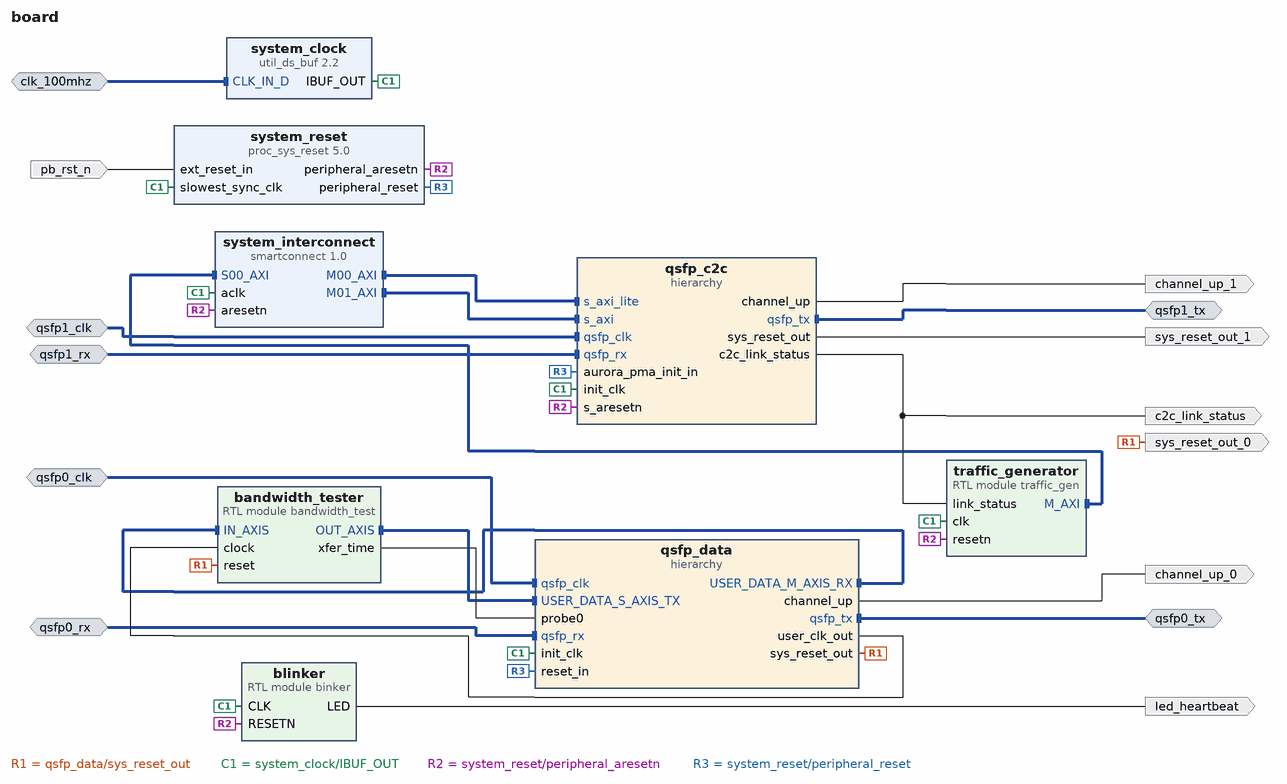
[diagram p0: block diagram of the top level]
# Vivado block design board, xczu19eg-ffvc1760-2-i, Vivado 2021.1
create_bd_design board

create_bd_intf_port -mode Slave -vlnv xilinx.com:interface:diff_clock_rtl:1.0 clk_100mhz
create_bd_intf_port -mode Slave -vlnv xilinx.com:interface:diff_clock_rtl:1.0 qsfp1_clk
set_property -dict {CONFIG.FREQ_HZ 322265625} [get_bd_intf_ports qsfp1_clk]
create_bd_intf_port -mode Slave -vlnv xilinx.com:display_aurora:GT_Serial_Transceiver_Pins_RX_rtl:1.0 qsfp1_rx
create_bd_intf_port -mode Master -vlnv xilinx.com:display_aurora:GT_Serial_Transceiver_Pins_TX_rtl:1.0 qsfp1_tx
create_bd_intf_port -mode Slave -vlnv xilinx.com:interface:diff_clock_rtl:1.0 qsfp0_clk
set_property -dict {CONFIG.FREQ_HZ 322265625} [get_bd_intf_ports qsfp0_clk]
create_bd_intf_port -mode Master -vlnv xilinx.com:display_aurora:GT_Serial_Transceiver_Pins_TX_rtl:1.0 qsfp0_tx
create_bd_intf_port -mode Slave -vlnv xilinx.com:display_aurora:GT_Serial_Transceiver_Pins_RX_rtl:1.0 qsfp0_rx
create_bd_port -dir O led_heartbeat
create_bd_port -dir I -type rst pb_rst_n
create_bd_port -dir O channel_up_1
create_bd_port -dir O -type rst sys_reset_out_1
set_property -dict {CONFIG.POLARITY ACTIVE_HIGH} [get_bd_ports sys_reset_out_1]
create_bd_port -dir O -type rst sys_reset_out_0
set_property -dict {CONFIG.POLARITY ACTIVE_HIGH} [get_bd_ports sys_reset_out_0]
create_bd_port -dir O channel_up_0
create_bd_port -dir O c2c_link_status

create_bd_cell -type ip -vlnv xilinx.com:ip:util_ds_buf:2.2 system_clock
create_bd_cell -type module -reference binker blinker
create_bd_cell -type ip -vlnv xilinx.com:ip:proc_sys_reset:5.0 system_reset
create_bd_cell -type ip -vlnv xilinx.com:ip:smartconnect:1.0 system_interconnect
set_property -dict {CONFIG.NUM_MI 2 CONFIG.NUM_SI 1} [get_bd_cells system_interconnect]
create_bd_cell -type hier qsfp_c2c
create_bd_cell -type module -reference bandwidth_test bandwidth_tester
create_bd_cell -type hier qsfp_data
create_bd_cell -type module -reference traffic_gen traffic_generator
set_property -dict {CONFIG.AXI_TARGET 0x40001000} [get_bd_cells traffic_generator]

# ---- hierarchy /qsfp_c2c ----
current_bd_instance /qsfp_c2c
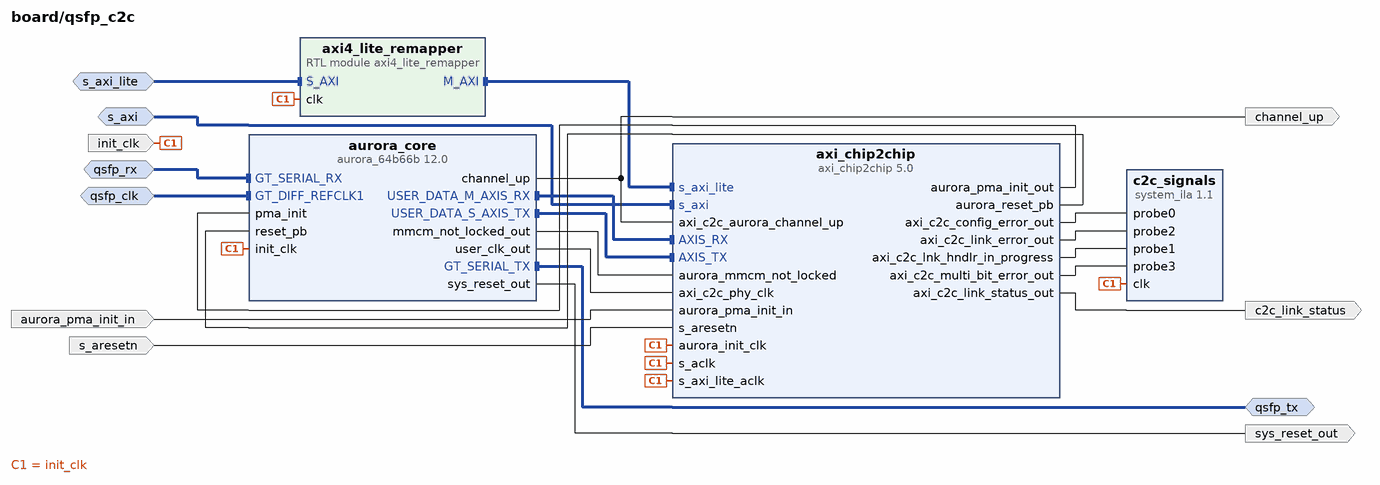
[diagram p1: block diagram inside /qsfp_c2c]
create_bd_intf_pin -mode Slave -vlnv xilinx.com:display_aurora:GT_Serial_Transceiver_Pins_RX_rtl:1.0 qsfp_rx
create_bd_intf_pin -mode Slave -vlnv xilinx.com:interface:diff_clock_rtl:1.0 qsfp_clk
create_bd_intf_pin -mode Master -vlnv xilinx.com:display_aurora:GT_Serial_Transceiver_Pins_TX_rtl:1.0 qsfp_tx
create_bd_intf_pin -mode Slave -vlnv xilinx.com:interface:aximm_rtl:1.0 s_axi_lite
create_bd_intf_pin -mode Slave -vlnv xilinx.com:interface:aximm_rtl:1.0 s_axi
create_bd_pin -dir I -type clk init_clk
create_bd_pin -dir O channel_up
create_bd_pin -dir O -type rst sys_reset_out
create_bd_pin -dir I -type rst aurora_pma_init_in
create_bd_pin -dir I -type rst s_aresetn
create_bd_pin -dir O c2c_link_status

create_bd_cell -type ip -vlnv xilinx.com:ip:aurora_64b66b:12.0 aurora_core
set_property -dict [list \
  CONFIG.CHANNEL_ENABLE X0Y16 \
  CONFIG.C_AURORA_LANES 1 \
  CONFIG.C_GT_CLOCK_1 GTYQ0 \
  CONFIG.C_GT_TYPE GTY \
  CONFIG.C_LINE_RATE 10.3125 \
  CONFIG.C_REFCLK_FREQUENCY 322.265625 \
  CONFIG.C_REFCLK_SOURCE MGTREFCLK0_of_Quad_X0Y4 \
  CONFIG.C_START_LANE X0Y16 \
  CONFIG.C_START_QUAD Quad_X0Y4 \
  CONFIG.C_UCOLUMN_USED left \
  CONFIG.SupportLevel 1 \
  CONFIG.TransceiverControl false \
  CONFIG.drp_mode Disabled \
  CONFIG.interface_mode Streaming \
] [get_bd_cells aurora_core]
create_bd_cell -type ip -vlnv xilinx.com:ip:axi_chip2chip:5.0 axi_chip2chip
set_property -dict [list \
  CONFIG.C_AXI_DATA_WIDTH 32 \
  CONFIG.C_AXI_STB_WIDTH 4 \
  CONFIG.C_EN_AXI_LINK_HNDLR true \
  CONFIG.C_INCLUDE_AXILITE 1 \
  CONFIG.C_INTERFACE_MODE 0 \
  CONFIG.C_INTERFACE_TYPE 2 \
  CONFIG.C_MASTER_FPGA 1 \
  CONFIG.C_M_AXI_ID_WIDTH 12 \
  CONFIG.C_M_AXI_WUSER_WIDTH 0 \
] [get_bd_cells axi_chip2chip]
create_bd_cell -type ip -vlnv xilinx.com:ip:system_ila:1.1 c2c_signals
set_property -dict [list \
  CONFIG.C_MON_TYPE NATIVE \
  CONFIG.C_NUM_OF_PROBES 5 \
  CONFIG.C_PROBE0_TYPE 0 \
  CONFIG.C_PROBE1_TYPE 0 \
  CONFIG.C_PROBE2_TYPE 0 \
  CONFIG.C_PROBE3_TYPE 0 \
  CONFIG.C_PROBE4_TYPE 0 \
] [get_bd_cells c2c_signals]
create_bd_cell -type module -reference axi4_lite_remapper axi4_lite_remapper

# ---- hierarchy /qsfp_data ----
current_bd_instance /qsfp_data
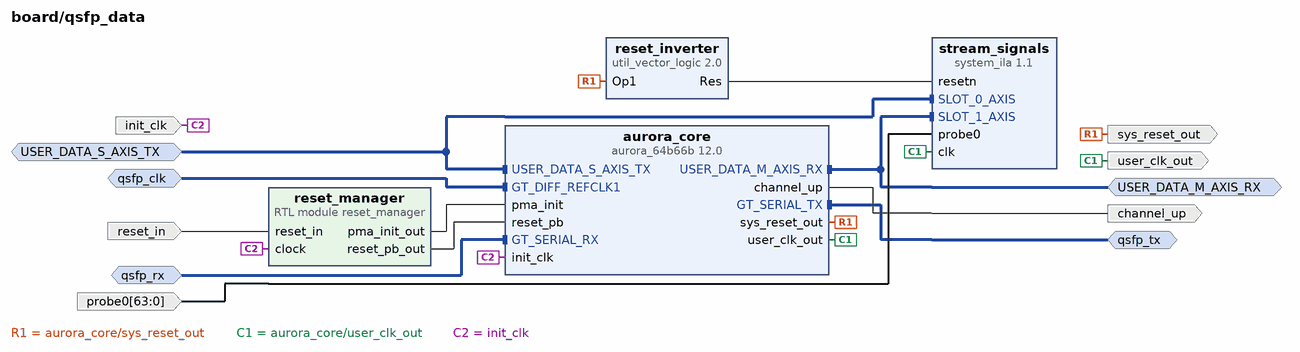
[diagram p2: block diagram inside /qsfp_data]
create_bd_intf_pin -mode Slave -vlnv xilinx.com:interface:diff_clock_rtl:1.0 qsfp_clk
create_bd_intf_pin -mode Slave -vlnv xilinx.com:interface:axis_rtl:1.0 USER_DATA_S_AXIS_TX
create_bd_intf_pin -mode Master -vlnv xilinx.com:interface:axis_rtl:1.0 USER_DATA_M_AXIS_RX
create_bd_intf_pin -mode Master -vlnv xilinx.com:display_aurora:GT_Serial_Transceiver_Pins_TX_rtl:1.0 qsfp_tx
create_bd_intf_pin -mode Slave -vlnv xilinx.com:display_aurora:GT_Serial_Transceiver_Pins_RX_rtl:1.0 qsfp_rx
create_bd_pin -dir I -type clk init_clk
create_bd_pin -dir O channel_up
create_bd_pin -dir O -type rst sys_reset_out
create_bd_pin -dir O -type clk user_clk_out
create_bd_pin -dir I -from 63 -to 0 probe0
create_bd_pin -dir I -type rst reset_in

create_bd_cell -type ip -vlnv xilinx.com:ip:aurora_64b66b:12.0 aurora_core
set_property -dict [list \
  CONFIG.CHANNEL_ENABLE {X0Y12 X0Y13 X0Y14 X0Y15} \
  CONFIG.C_AURORA_LANES 4 \
  CONFIG.C_GT_CLOCK_1 GTYQ0 \
  CONFIG.C_GT_TYPE GTY \
  CONFIG.C_LINE_RATE 25.78125 \
  CONFIG.C_REFCLK_FREQUENCY 322.265625 \
  CONFIG.C_REFCLK_SOURCE MGTREFCLK0_of_Quad_X0Y3 \
  CONFIG.C_START_LANE X0Y12 \
  CONFIG.C_START_QUAD Quad_X0Y3 \
  CONFIG.C_UCOLUMN_USED left \
  CONFIG.SupportLevel 1 \
  CONFIG.drp_mode Disabled \
  CONFIG.interface_mode Streaming \
] [get_bd_cells aurora_core]
create_bd_cell -type ip -vlnv xilinx.com:ip:util_vector_logic:2.0 reset_inverter
set_property -dict {CONFIG.C_OPERATION not CONFIG.C_SIZE 1} [get_bd_cells reset_inverter]
create_bd_cell -type ip -vlnv xilinx.com:ip:system_ila:1.1 stream_signals
set_property -dict [list \
  CONFIG.C_MON_TYPE MIX \
  CONFIG.C_NUM_MONITOR_SLOTS 2 \
  CONFIG.C_NUM_OF_PROBES 1 \
  CONFIG.C_PROBE0_TYPE 0 \
  CONFIG.C_SLOT_0_APC_EN 0 \
  CONFIG.C_SLOT_0_AXI_DATA_SEL 1 \
  CONFIG.C_SLOT_0_AXI_TRIG_SEL 1 \
  CONFIG.C_SLOT_0_INTF_TYPE xilinx.com:interface:axis_rtl:1.0 \
  CONFIG.C_SLOT_0_TYPE 0 \
  CONFIG.C_SLOT_1_APC_EN 0 \
  CONFIG.C_SLOT_1_AXI_DATA_SEL 1 \
  CONFIG.C_SLOT_1_AXI_TRIG_SEL 1 \
  CONFIG.C_SLOT_1_INTF_TYPE xilinx.com:interface:axis_rtl:1.0 \
] [get_bd_cells stream_signals]
create_bd_cell -type module -reference reset_manager reset_manager

# ---- connections ----

current_bd_instance /qsfp_c2c
connect_bd_intf_net [get_bd_intf_pins s_axi] [get_bd_intf_pins axi_chip2chip/s_axi]
connect_bd_intf_net [get_bd_intf_pins qsfp_rx] [get_bd_intf_pins aurora_core/GT_SERIAL_RX]
connect_bd_intf_net [get_bd_intf_pins qsfp_clk] [get_bd_intf_pins aurora_core/GT_DIFF_REFCLK1]
connect_bd_intf_net [get_bd_intf_pins qsfp_tx] [get_bd_intf_pins aurora_core/GT_SERIAL_TX]
connect_bd_intf_net [get_bd_intf_pins aurora_core/USER_DATA_M_AXIS_RX] [get_bd_intf_pins axi_chip2chip/AXIS_RX]
connect_bd_intf_net -intf_net axi4_lite_remapper_0_M_AXI [get_bd_intf_pins axi4_lite_remapper/M_AXI] [get_bd_intf_pins axi_chip2chip/s_axi_lite]
connect_bd_intf_net -intf_net axi_chip2chip_0_AXIS_TX [get_bd_intf_pins aurora_core/USER_DATA_S_AXIS_TX] [get_bd_intf_pins axi_chip2chip/AXIS_TX]
connect_bd_intf_net [get_bd_intf_pins s_axi_lite] [get_bd_intf_pins axi4_lite_remapper/S_AXI]
connect_bd_net [get_bd_pins aurora_core/channel_up] [get_bd_pins channel_up] [get_bd_pins axi_chip2chip/axi_c2c_aurora_channel_up]
connect_bd_net [get_bd_pins aurora_core/mmcm_not_locked_out] [get_bd_pins axi_chip2chip/aurora_mmcm_not_locked]
connect_bd_net [get_bd_pins aurora_core/sys_reset_out] [get_bd_pins sys_reset_out]
connect_bd_net [get_bd_pins aurora_core/user_clk_out] [get_bd_pins axi_chip2chip/axi_c2c_phy_clk]
connect_bd_net [get_bd_pins aurora_pma_init_in] [get_bd_pins axi_chip2chip/aurora_pma_init_in]
connect_bd_net -net axi_chip2chip_0_aurora_pma_init_out [get_bd_pins axi_chip2chip/aurora_pma_init_out] [get_bd_pins aurora_core/pma_init]
connect_bd_net -net axi_chip2chip_0_aurora_reset_pb [get_bd_pins axi_chip2chip/aurora_reset_pb] [get_bd_pins aurora_core/reset_pb]
connect_bd_net -net axi_chip2chip_0_axi_c2c_config_error_out [get_bd_pins axi_chip2chip/axi_c2c_config_error_out] [get_bd_pins c2c_signals/probe0]
connect_bd_net -net axi_chip2chip_0_axi_c2c_link_error_out [get_bd_pins axi_chip2chip/axi_c2c_link_error_out] [get_bd_pins c2c_signals/probe2]
connect_bd_net -net axi_chip2chip_0_axi_c2c_lnk_hndlr_in_progress [get_bd_pins axi_chip2chip/axi_c2c_lnk_hndlr_in_progress] \
  [get_bd_pins c2c_signals/probe1]
connect_bd_net -net axi_chip2chip_0_axi_c2c_multi_bit_error_out [get_bd_pins axi_chip2chip/axi_c2c_multi_bit_error_out] \
  [get_bd_pins c2c_signals/probe3]
connect_bd_net [get_bd_pins axi_chip2chip/axi_c2c_link_status_out] [get_bd_pins c2c_link_status]
connect_bd_net [get_bd_pins init_clk] \
  [get_bd_pins aurora_core/init_clk] [get_bd_pins axi_chip2chip/aurora_init_clk] [get_bd_pins axi_chip2chip/s_axi_lite_aclk] \
  [get_bd_pins axi_chip2chip/s_aclk] [get_bd_pins c2c_signals/clk] [get_bd_pins axi4_lite_remapper/clk]
connect_bd_net [get_bd_pins s_aresetn] [get_bd_pins axi_chip2chip/s_aresetn]
set_property HDL_ATTRIBUTE.DEBUG true [get_bd_nets axi_chip2chip_0_axi_c2c_config_error_out]
set_property HDL_ATTRIBUTE.MARK_DEBUG true [get_bd_nets axi_chip2chip_0_axi_c2c_config_error_out]
set_property HDL_ATTRIBUTE.DEBUG true [get_bd_nets axi_chip2chip_0_axi_c2c_link_error_out]
set_property HDL_ATTRIBUTE.MARK_DEBUG true [get_bd_nets axi_chip2chip_0_axi_c2c_link_error_out]
set_property HDL_ATTRIBUTE.DEBUG true [get_bd_nets axi_chip2chip_0_axi_c2c_lnk_hndlr_in_progress]
set_property HDL_ATTRIBUTE.MARK_DEBUG true [get_bd_nets axi_chip2chip_0_axi_c2c_lnk_hndlr_in_progress]
set_property HDL_ATTRIBUTE.DEBUG true [get_bd_nets axi_chip2chip_0_axi_c2c_multi_bit_error_out]
set_property HDL_ATTRIBUTE.MARK_DEBUG true [get_bd_nets axi_chip2chip_0_axi_c2c_multi_bit_error_out]

current_bd_instance /qsfp_data
connect_bd_intf_net [get_bd_intf_pins qsfp_clk] [get_bd_intf_pins aurora_core/GT_DIFF_REFCLK1]
connect_bd_intf_net -intf_net Conn2 [get_bd_intf_pins USER_DATA_S_AXIS_TX] [get_bd_intf_pins aurora_core/USER_DATA_S_AXIS_TX]
connect_bd_intf_net [get_bd_intf_pins USER_DATA_S_AXIS_TX] [get_bd_intf_pins stream_signals/SLOT_0_AXIS]
connect_bd_intf_net -intf_net Conn3 [get_bd_intf_pins USER_DATA_M_AXIS_RX] [get_bd_intf_pins aurora_core/USER_DATA_M_AXIS_RX]
connect_bd_intf_net [get_bd_intf_pins USER_DATA_M_AXIS_RX] [get_bd_intf_pins stream_signals/SLOT_1_AXIS]
connect_bd_intf_net [get_bd_intf_pins qsfp_tx] [get_bd_intf_pins aurora_core/GT_SERIAL_TX]
connect_bd_intf_net [get_bd_intf_pins qsfp_rx] [get_bd_intf_pins aurora_core/GT_SERIAL_RX]
connect_bd_net -net aurora_64b66b_0_channel_up [get_bd_pins aurora_core/channel_up] [get_bd_pins channel_up]
connect_bd_net -net aurora_64b66b_0_sys_reset_out [get_bd_pins aurora_core/sys_reset_out] [get_bd_pins sys_reset_out] [get_bd_pins reset_inverter/Op1]
connect_bd_net -net aurora_64b66b_0_user_clk_out [get_bd_pins aurora_core/user_clk_out] [get_bd_pins user_clk_out] [get_bd_pins stream_signals/clk]
connect_bd_net [get_bd_pins init_clk] [get_bd_pins aurora_core/init_clk] [get_bd_pins reset_manager/clock]
connect_bd_net -net probe0_1 [get_bd_pins probe0] [get_bd_pins stream_signals/probe0]
connect_bd_net [get_bd_pins reset_in] [get_bd_pins reset_manager/reset_in]
connect_bd_net [get_bd_pins reset_inverter/Res] [get_bd_pins stream_signals/resetn]
connect_bd_net -net reset_manager_0_pma_init_out [get_bd_pins reset_manager/pma_init_out] [get_bd_pins aurora_core/pma_init]
connect_bd_net -net reset_manager_0_reset_pb_out [get_bd_pins reset_manager/reset_pb_out] [get_bd_pins aurora_core/reset_pb]
set_property HDL_ATTRIBUTE.DEBUG true [get_bd_intf_nets Conn2]
set_property HDL_ATTRIBUTE.DEBUG true [get_bd_intf_nets Conn3]
set_property HDL_ATTRIBUTE.MARK_DEBUG true [get_bd_intf_nets Conn3]
set_property HDL_ATTRIBUTE.DEBUG true [get_bd_nets probe0_1]

current_bd_instance /
connect_bd_intf_net -intf_net CLK_IN_D_0_1 [get_bd_intf_ports clk_100mhz] [get_bd_intf_pins system_clock/CLK_IN_D]
connect_bd_intf_net -intf_net aurora_64b66b_0_USER_DATA_M_AXIS_RX [get_bd_intf_pins qsfp_data/USER_DATA_M_AXIS_RX] [get_bd_intf_pins bandwidth_tester/IN_AXIS]
connect_bd_intf_net -intf_net bandwidth_test_0_OUT_AXIS [get_bd_intf_pins bandwidth_tester/OUT_AXIS] [get_bd_intf_pins qsfp_data/USER_DATA_S_AXIS_TX]
connect_bd_intf_net [get_bd_intf_ports qsfp0_clk] [get_bd_intf_pins qsfp_data/qsfp_clk]
connect_bd_intf_net [get_bd_intf_ports qsfp0_rx] [get_bd_intf_pins qsfp_data/qsfp_rx]
connect_bd_intf_net [get_bd_intf_ports qsfp1_clk] [get_bd_intf_pins qsfp_c2c/qsfp_clk]
connect_bd_intf_net [get_bd_intf_ports qsfp1_rx] [get_bd_intf_pins qsfp_c2c/qsfp_rx]
connect_bd_intf_net -intf_net qsfp_c2c_qsfp1_tx [get_bd_intf_ports qsfp1_tx] [get_bd_intf_pins qsfp_c2c/qsfp_tx]
connect_bd_intf_net -intf_net qsfp_data_qsfp0_tx [get_bd_intf_ports qsfp0_tx] [get_bd_intf_pins qsfp_data/qsfp_tx]
connect_bd_intf_net [get_bd_intf_pins system_interconnect/M00_AXI] [get_bd_intf_pins qsfp_c2c/s_axi_lite]
connect_bd_intf_net [get_bd_intf_pins system_interconnect/M01_AXI] [get_bd_intf_pins qsfp_c2c/s_axi]
connect_bd_intf_net -intf_net traffic_gen_0_M_AXI [get_bd_intf_pins traffic_generator/M_AXI] [get_bd_intf_pins system_interconnect/S00_AXI]
connect_bd_net -net aurora_64b66b_0_sys_reset_out [get_bd_pins qsfp_data/sys_reset_out] \
  [get_bd_ports sys_reset_out_0] [get_bd_pins bandwidth_tester/reset]
connect_bd_net -net aurora_64b66b_0_user_clk_out [get_bd_pins qsfp_data/user_clk_out] [get_bd_pins bandwidth_tester/clock]
connect_bd_net -net aurora_core_channel_up [get_bd_pins qsfp_c2c/channel_up] [get_bd_ports channel_up_1]
connect_bd_net -net bandwidth_tester_xfer_time [get_bd_pins bandwidth_tester/xfer_time] [get_bd_pins qsfp_data/probe0]
connect_bd_net -net binker_0_LED [get_bd_pins blinker/LED] [get_bd_ports led_heartbeat]
connect_bd_net -net ext_reset_in_0_1 [get_bd_ports pb_rst_n] [get_bd_pins system_reset/ext_reset_in]
# net gt_reset_out has one end: 
connect_bd_net -net qsfp_c2c_axi_c2c_link_status_out_0 [get_bd_pins qsfp_c2c/c2c_link_status] \
  [get_bd_ports c2c_link_status] [get_bd_pins traffic_generator/link_status]
connect_bd_net [get_bd_pins qsfp_c2c/sys_reset_out] [get_bd_ports sys_reset_out_1]
connect_bd_net [get_bd_pins qsfp_data/channel_up] [get_bd_ports channel_up_0]
connect_bd_net [get_bd_pins system_clock/IBUF_OUT] \
  [get_bd_pins blinker/CLK] [get_bd_pins system_reset/slowest_sync_clk] [get_bd_pins system_interconnect/aclk] \
  [get_bd_pins qsfp_c2c/init_clk] [get_bd_pins qsfp_data/init_clk] [get_bd_pins traffic_generator/clk]
connect_bd_net [get_bd_pins system_reset/peripheral_aresetn] \
  [get_bd_pins blinker/RESETN] [get_bd_pins system_interconnect/aresetn] [get_bd_pins qsfp_c2c/s_aresetn] \
  [get_bd_pins traffic_generator/resetn]
connect_bd_net [get_bd_pins system_reset/peripheral_reset] [get_bd_pins qsfp_c2c/aurora_pma_init_in] [get_bd_pins qsfp_data/reset_in]
set_property HDL_ATTRIBUTE.DEBUG true [get_bd_intf_nets aurora_64b66b_0_USER_DATA_M_AXIS_RX]
set_property HDL_ATTRIBUTE.MARK_DEBUG true [get_bd_intf_nets aurora_64b66b_0_USER_DATA_M_AXIS_RX]
set_property HDL_ATTRIBUTE.DEBUG true [get_bd_intf_nets bandwidth_test_0_OUT_AXIS]
set_property HDL_ATTRIBUTE.MARK_DEBUG true [get_bd_intf_nets bandwidth_test_0_OUT_AXIS]
set_property HDL_ATTRIBUTE.DEBUG true [get_bd_nets bandwidth_tester_xfer_time]
set_property HDL_ATTRIBUTE.MARK_DEBUG true [get_bd_nets bandwidth_tester_xfer_time]
set_property HDL_ATTRIBUTE.DEBUG true [get_bd_nets gt_reset_out]
set_property HDL_ATTRIBUTE.MARK_DEBUG true [get_bd_nets gt_reset_out]

# ---- address map ----
assign_bd_address -offset 0x00000000 -range 1G -target_address_space [get_bd_addr_spaces qsfp_c2c/axi4_lite_remapper/M_AXI] [get_bd_addr_segs qsfp_c2c/axi_chip2chip/s_axi_lite/Reg]
assign_bd_address -offset 0x40000000 -range 1G -target_address_space [get_bd_addr_spaces traffic_generator/M_AXI] [get_bd_addr_segs qsfp_c2c/axi4_lite_remapper/S_AXI/reg0]

validate_bd_design
save_bd_design
